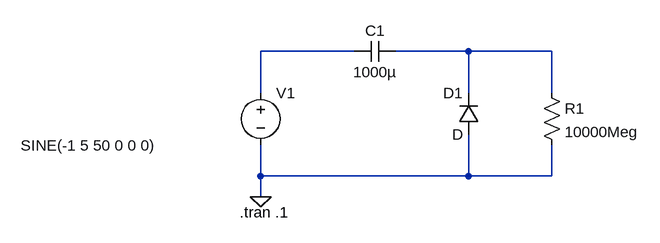
[diagram p0: schematic Diodo - Grampeador.asc]
Diodo - Grampeador.asc, the LTspice schematic file:
Version 4
SHEET 1 880 680
WIRE 160 96 16 96
WIRE 336 96 224 96
WIRE 464 96 336 96
WIRE 16 160 16 96
WIRE 336 160 336 96
WIRE 464 160 464 96
WIRE 16 288 16 240
WIRE 336 288 336 224
WIRE 336 288 16 288
WIRE 464 288 464 240
WIRE 464 288 336 288
WIRE 16 320 16 288
FLAG 16 320 0
SYMBOL voltage 16 144 R0
WINDOW 3 -369 97 Left 2
WINDOW 123 0 0 Left 2
WINDOW 39 0 0 Left 2
SYMATTR Value SINE(-1 5 50 0 0 0)
SYMATTR InstName V1
SYMBOL cap 160 112 R270
WINDOW 0 32 32 VTop 2
WINDOW 3 0 32 VBottom 2
SYMATTR InstName C1
SYMATTR Value 1000µ
SYMBOL diode 352 224 R180
WINDOW 0 24 64 Left 2
WINDOW 3 24 0 Left 2
SYMATTR InstName D1
SYMBOL res 448 144 R0
SYMATTR InstName R1
SYMATTR Value 10000Meg
TEXT -16 344 Left 2 !.tran .1

The netlist it stands for:
* Diodo - Grampeador.asc
V1 N001 0 SINE(-1 5 50 0 0 0)
C1 N001 N002 1000µ
D1 0 N002 D
R1 N002 0 10000Meg
.model D D
.lib standard.dio
.tran .1
.backanno
.end